# Altium schematic sheet MCU.SchDoc
size A3
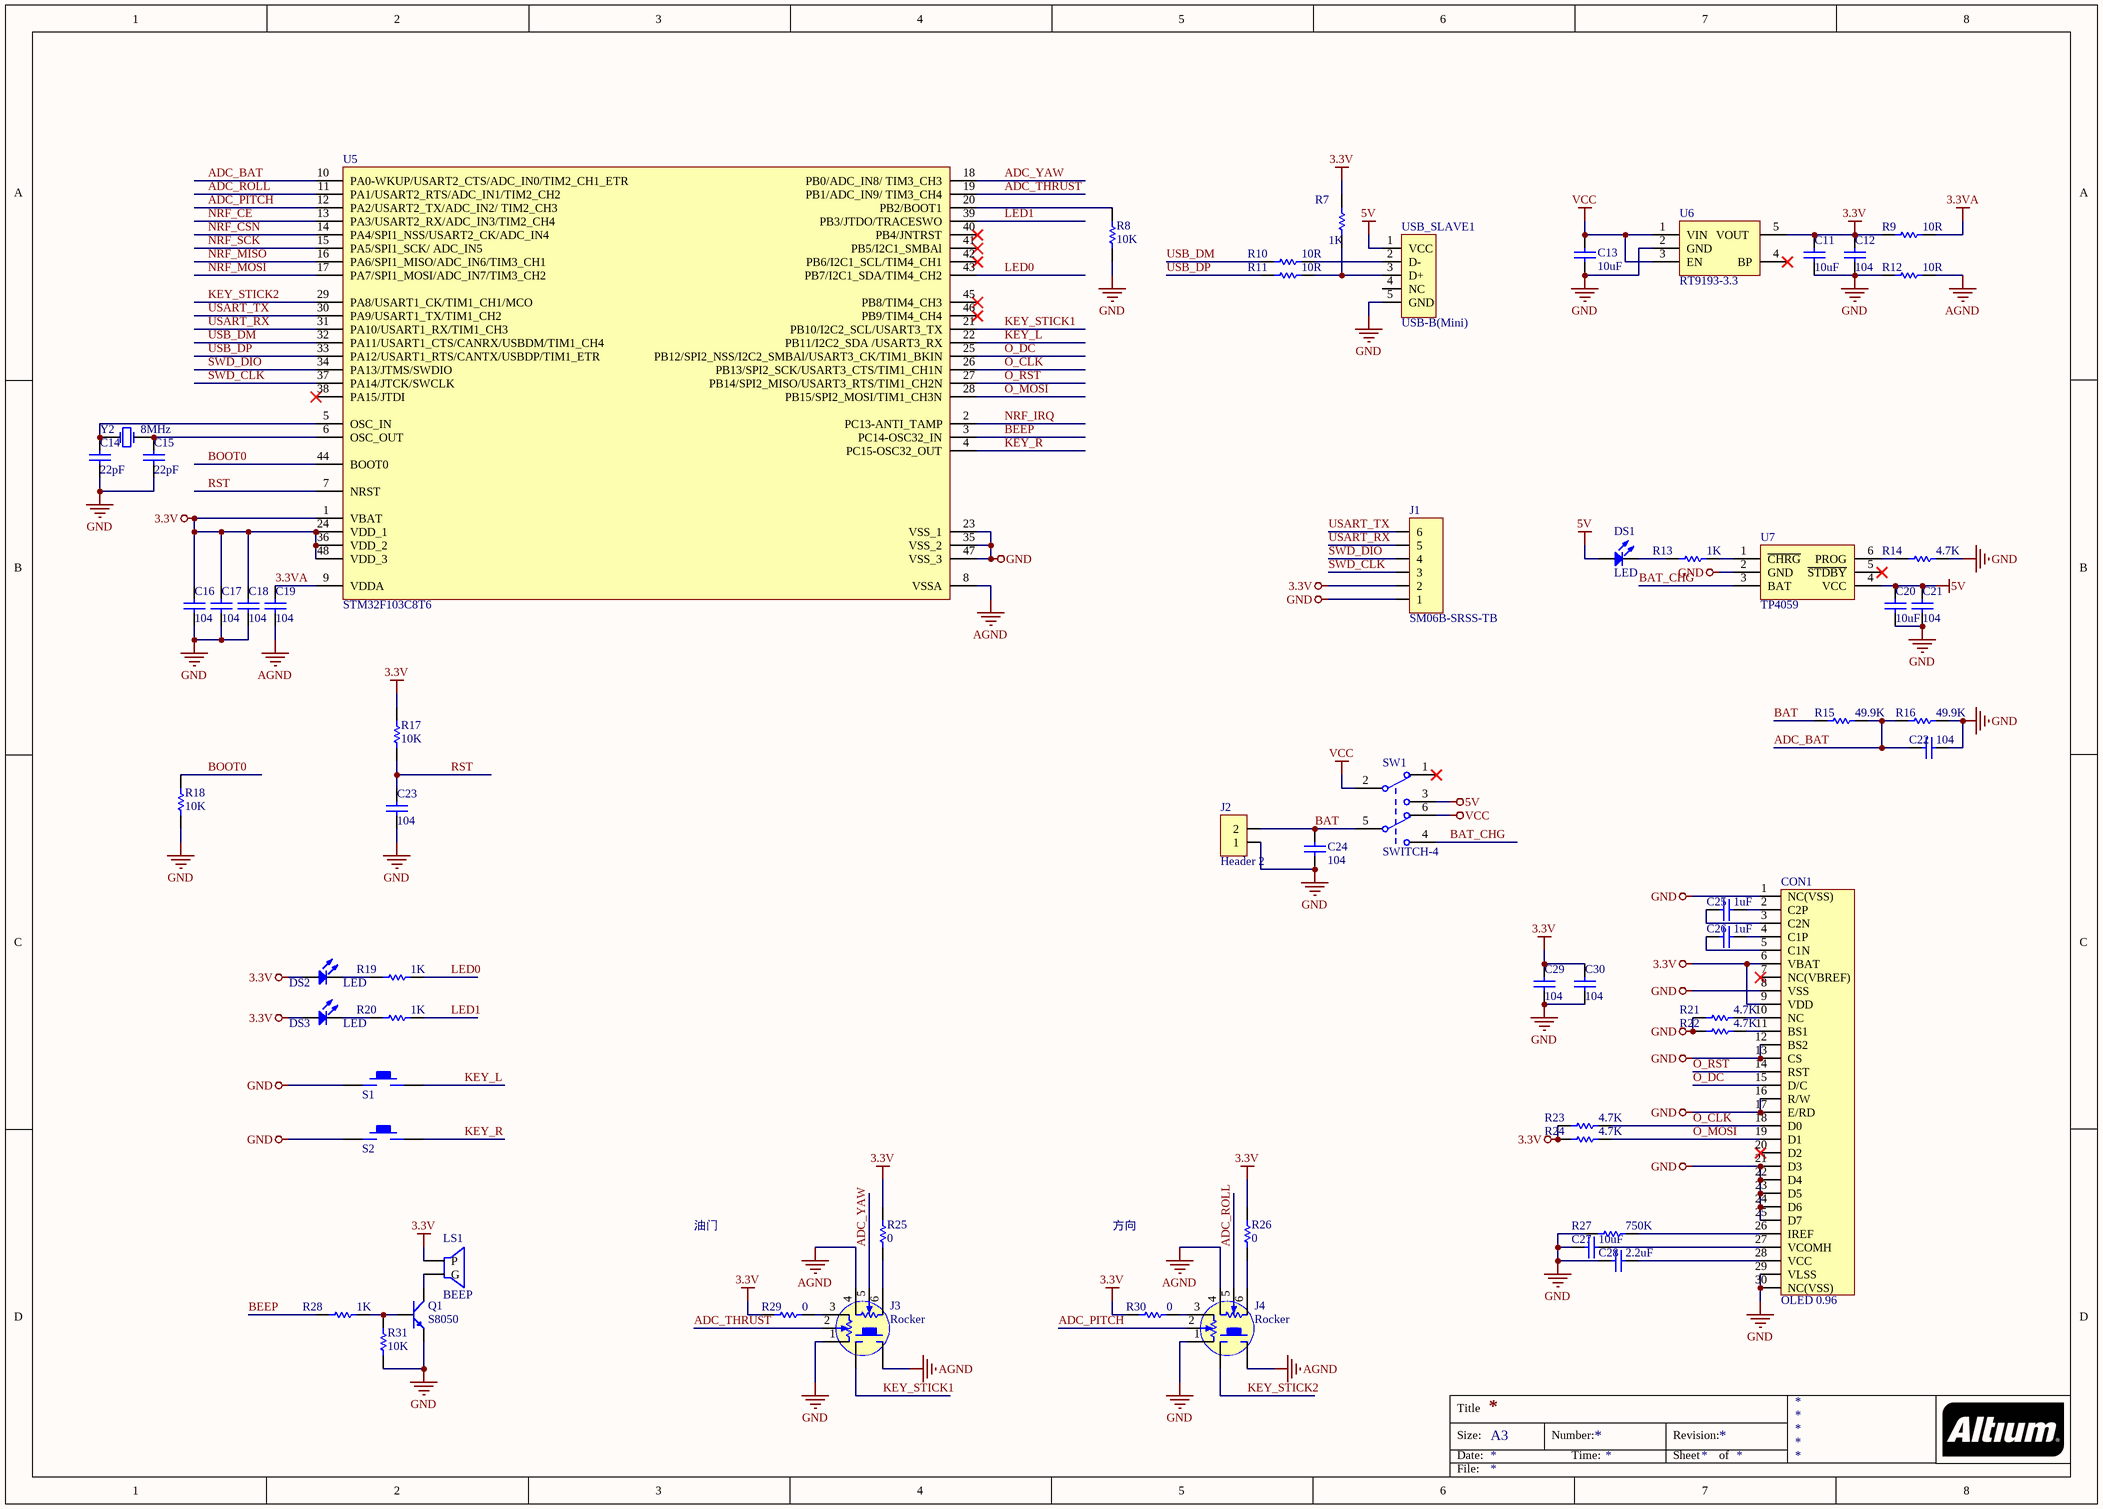
[diagram p0: MCU.SchDoc]

## Parts
C11  10uF  [C0603]
C12  104  [C0603]
C13  10uF  [C0603]
C14  22pF  [C0603]
C15  22pF  [C0603]
C16  104  [C0603]
C17  104  [C0603]
C18  104  [C0603]
C19  104  [C0603]
C20  10uF  [C0603]
C21  104  [C0603]
C22  104  [C0603]
C23  104  [C0603]
C24  104  [C0603]
C25  1uF  [C0603]
C26  1uF  [C0603]
C27  10uF  [C0603]
C28  2.2uF  [C0603]
C29  104  [C0603]
C30  104  [C0603]
CON1  OLED 0.96  [OLED_0.96-L]
DS1  LED  [LED0603]
DS2  LED  [LED0603]
DS3  LED  [LED0603]
J1  SM06B-SRSS-TB  [SM06B-SRSS-TB]
J2  Header 2  [HDR1X2-2MM]
J3  Rocker  [Rocker-RKJXV1224005]
J4  Rocker  [Rocker-RKJXV1224005]
LS1  BEEP  [BEEP-9]
Q1  S8050  [SOT-23R]
R7  1K  [R0603]
R8  10K  [R0603]
R9  10R  [R0603]
R10  10R  [R0603]
R11  10R  [R0603]
R12  10R  [R0603]
R13  1K  [R0603]
R14  4.7K  [R0603]
R15  49.9K  [R0603]
R16  49.9K  [R0603]
R17  10K  [R0603]
R18  10K  [R0603]
R19  1K  [R0603]
R20  1K  [R0603]
R21  4.7K  [R0603]
R22  4.7K  [R0603]
R23  4.7K  [R0603]
R24  4.7K  [R0603]
R25  0  [R0603]
R26  0  [R0603]
R27  750K  [R0603]
R28  1K  [R0603]
R29  0  [R0603]
R30  0  [R0603]
R31  10K  [R0603]
S1  KEY  [KEY-3X6X3.5-C]  (value not drawn)
S2  KEY  [KEY-3X6X3.5-C]  (value not drawn)
SW1  SWITCH-4  [SW-MSS22D18G2]
U5  STM32F103C8T6  [LQFP-48]
U6  RT9193-3.3  [SOT-23-5]
U7  TP4059  [SOT23-6]
USB_SLAVE1  USB-B(Mini)  [USB-MicroUSB]
Y2  8MHz  [X-NX5032GA]

## Nets
3.3V: C11.2 C12.2 C16.2 C17.2 C18.2 C29.1 C30.1 CON1.6(VBAT) CON1.9(VDD) DS2.1(A) DS3.1(A) J1.2 LS1.1(P) R7.2 R9.1 R17.2 R23.1 R24.1 R25.2 R26.2 R29.2 R30.2 U5.1(VBAT) U5.24(VDD_1) U5.36(VDD_2) U5.48(VDD_3) U6.5(VOUT)
3.3VA: C19.2 R9.2 U5.9(VDDA)
5V: C20.2 C21.2 DS1.1(A) SW1.3 U7.4(VCC) USB_SLAVE1.1(VCC)
AGND: C19.1 J3.4 J3.J1 J4.4 J4.J1 R12.2 U5.8(VSSA)
GND: C11.1 C12.1 C13.1 C14.1 C15.1 C16.1 C17.1 C18.1 C20.1 C21.1 C22.1 C23.1 C24.2 C27.2 C28.2 C29.2 C30.2 CON1.1(NC(VSS)) CON1.8(VSS) CON1.12(BS2) CON1.13(CS) CON1.16(R/W) CON1.17(E/RD) CON1.21(D3) CON1.22(D4) CON1.23(D5) CON1.24(D6) CON1.25(D7) CON1.29(VLSS) CON1.30(NC(VSS)) J1.1 J2.1 J3.1 J4.1 Q1.1(E) R8.1 R12.1 R14.2 R16.2 R18.1 R21.1 R22.1 R27.1 R31.1 S1.1 S2.1 U5.23(VSS_1) U5.35(VSS_2) U5.47(VSS_3) U6.2(GND) U7.2(GND) USB_SLAVE1.5(GND)
VCC: C13.2 SW1.2 SW1.6 U6.1(VIN) U6.3(EN)
ADC_BAT: C22.2 R15.2 R16.1 U5.10(PA0-WKUP/USART2_CTS/ADC_IN0/TIM2_CH1_ETR)
ADC_PITCH: J4.2 U5.12(PA2/USART2_TX/ADC_IN2/_TIM2_CH3)
ADC_ROLL: J4.5 U5.11(PA1/USART2_RTS/ADC_IN1/TIM2_CH2)
ADC_THRUST: J3.2 U5.19(PB1/ADC_IN9/_TIM3_CH4)
ADC_YAW: J3.5 U5.18(PB0/ADC_IN8/_TIM3_CH3)
BAT: C24.1 J2.2 R15.1 SW1.5
BAT_CHG: SW1.4 U7.3(BAT)
BEEP: R28.1 U5.3(PC14-OSC32_IN)
BOOT0: R18.2 U5.44(BOOT0)
KEY_L: S1.2 U5.22(PB11/I2C2_SDA_/USART3_RX)
KEY_R: S2.2 U5.4(PC15-OSC32_OUT)
KEY_STICK1: J3.J2 U5.21(PB10/I2C2_SCL/USART3_TX)
KEY_STICK2: J4.J2 U5.29(PA8/USART1_CK/TIM1_CH1/MCO)
LED0: R19.2 U5.43(PB7/I2C1_SDA/TIM4_CH2)
LED1: R20.2 U5.39(PB3/JTDO/TRACESWO)
NRF_CE: U5.13(PA3/USART2_RX/ADC_IN3/TIM2_CH4)
NRF_CSN: U5.14(PA4/SPI1_NSS/USART2_CK/ADC_IN4)
NRF_IRQ: U5.2(PC13-ANTI_TAMP)
NRF_MISO: U5.16(PA6/SPI1_MISO/ADC_IN6/TIM3_CH1)
NRF_MOSI: U5.17(PA7/SPI1_MOSI/ADC_IN7/TIM3_CH2)
NRF_SCK: U5.15(PA5/SPI1_SCK/_ADC_IN5)
O_CLK: CON1.18(D0) R23.2 U5.26(PB13/SPI2_SCK/USART3_CTS/TIM1_CH1N)
O_DC: CON1.15(D/C) U5.25(PB12/SPI2_NSS/I2C2_SMBAl/USART3_CK/TIM1_BKIN)
O_MOSI: CON1.19(D1) R24.2 U5.28(PB15/SPI2_MOSI/TIM1_CH3N)
O_RST: CON1.14(RST) U5.27(PB14/SPI2_MISO/USART3_RTS/TIM1_CH2N)
RST: C23.2 R17.1 U5.7(NRST)
SWD_CLK: J1.3 U5.37(PA14/JTCK/SWCLK)
SWD_DIO: J1.4 U5.34(PA13/JTMS/SWDIO)
USART_RX: J1.5 U5.31(PA10/USART1_RX/TIM1_CH3)
USART_TX: J1.6 U5.30(PA9/USART1_TX/TIM1_CH2)
USB_DM: R10.1 U5.32(PA11/USART1_CTS/CANRX/USBDM/TIM1_CH4)
USB_DP: R11.1 U5.33(PA12/USART1_RTS/CANTX/USBDP/TIM1_ETR)
NetC14_2: C14.2 U5.5(OSC_IN) Y2.1(OSC1)
NetC15_2: C15.2 U5.6(OSC_OUT) Y2.2(OSC2)
NetC25_1: C25.1 CON1.2(C2P)
NetC25_2: C25.2 CON1.3(C2N)
NetC26_1: C26.1 CON1.4(C1P)
NetC26_2: C26.2 CON1.5(C1N)
NetC27_1: C27.1 CON1.27(VCOMH)
NetC28_1: C28.1 CON1.28(VCC)
NetCON1_10: CON1.10(NC) R21.2
NetCON1_11: CON1.11(BS1) R22.2
NetCON1_26: CON1.26(IREF) R27.2
NetDS1_2: DS1.2(K) R13.1
NetDS2_2: DS2.2(K) R19.1
NetDS3_2: DS3.2(K) R20.1
NetJ3_3: J3.3 R29.1
NetJ3_6: J3.6 R25.1
NetJ4_3: J4.3 R30.1
NetJ4_6: J4.6 R26.1
NetLS1_2: LS1.2(G) Q1.3(C)
NetQ1_2: Q1.2(B) R28.2 R31.2
NetR7_1: R7.1 R11.2 USB_SLAVE1.3(D+)
NetR8_2: R8.2 U5.20(PB2/BOOT1)
NetR10_2: R10.2 USB_SLAVE1.2(D-)
NetR13_2: R13.2 U7.1(~{CHRG})
NetR14_1: R14.1 U7.6(PROG)

Not connected (* = marked no-connect by the designer): CON1 7(NC(VBREF))* 20(D2)*; SW1 1*; U5 38(PA15/JTDI)* 40(PB4/JNTRST)* 41(PB5/I2C1_SMBAl)* 42(PB6/I2C1_SCL/TIM4_CH1)* 45(PB8/TIM4_CH3)* 46(PB9/TIM4_CH4)*; U6 4(BP)*; U7 5(~{STDBY})*; USB_SLAVE1 4(NC)

## Notes on the sheet
- 油门
- 方向
- Title
- Size:
- Date:
- A3
- Number:
- Time:
- Revision:
- Sheet
- of
- File:

## Library data of the parts
C11-C30 = C0603: 电容; Published: 8-Jun-2000; LatestRevisionDate: 17-Jul-2002; LatestRevisionNote: Re-released for DXP Platform.; PackageReference: RAD-0.3; Publisher: Altium Limited; PackageDescription: Radial Cap, Thru-Hole; 2 Leads; 0.3 in Pin Spacing; UnitPrice: 0.02
DS1-DS3 = LED: Typical RED, GREEN, YELLOW, AMBER GaAs LED; Published: 8-Jun-2000; LatestRevisionDate: 17-Jul-2002; LatestRevisionNote: Re-released for DXP Platform.; PackageDocument: Feb-2002; PackageReference: 3.2X1.6X1.1; Publisher: Altium Limited; UnitPrice: 0.05
J2 = Header 2: Header, 2-Pin; LatestRevisionDate: 17-Jul-2002; LatestRevisionNote: Re-released for DXP Platform.; Publisher: Altium Limited
J3 J4 = Rocker: 航模摇杆
LS1 = BEEP: 蜂鸣器; UnitPrice: 0.5
Q1 = NPN: 8050/BCW846/BCW847
R7-R31 = RES0603: 电阻; Published: 8-Jun-2000; LatestRevisionDate: 17-Jul-2002; LatestRevisionNote: Re-released for DXP Platform.; PackageReference: AXIAL-0.3; Publisher: Altium Limited; PackageDescription: Axial Device, Thru-Hole; 2 Leads; 0.3 in Pin Spacing
S1 S2 = KEY: 普通轻触按钮
U7 = TP4059: 锂电池充电IC
USB_SLAVE1 = USB5
Y2 = XTAL: Crystal Oscillator; Published: 8-Jun-2000; LatestRevisionDate: 17-Jul-2002; LatestRevisionNote: Re-released for DXP Platform.; Publisher: Altium Limited